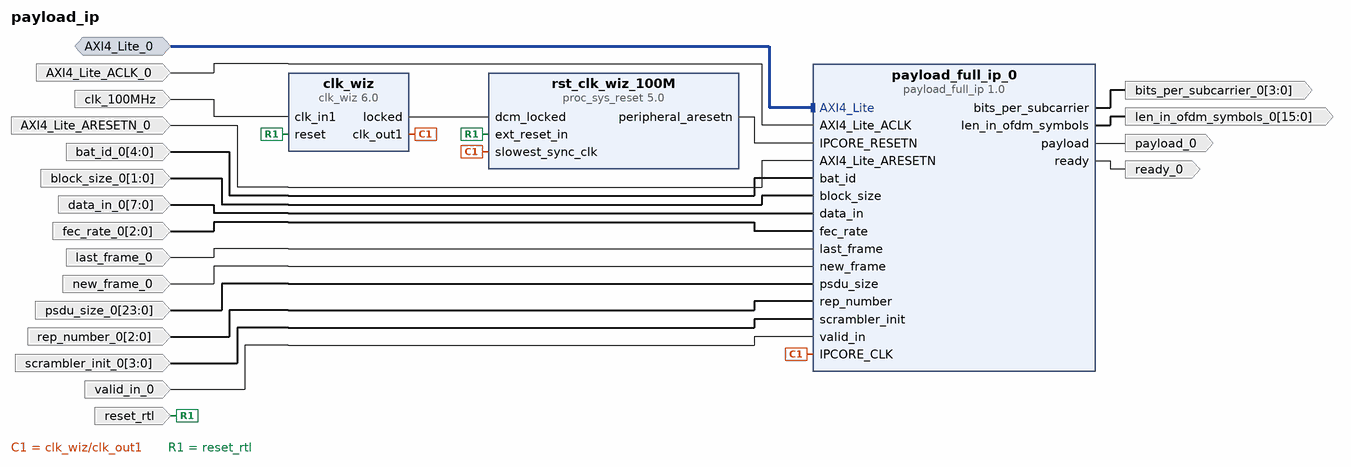
[diagram p0: block diagram of the top level]
# Vivado block design payload_ip, xc7z010clg400-1, Vivado 2023.2
create_bd_design payload_ip

create_bd_intf_port -mode Slave -vlnv xilinx.com:interface:aximm_rtl:1.0 AXI4_Lite_0
set_property -dict [list \
  CONFIG.ADDR_WIDTH 16 \
  CONFIG.ARUSER_WIDTH 0 \
  CONFIG.AWUSER_WIDTH 0 \
  CONFIG.BUSER_WIDTH 0 \
  CONFIG.DATA_WIDTH 32 \
  CONFIG.HAS_BRESP 1 \
  CONFIG.HAS_BURST 0 \
  CONFIG.HAS_CACHE 0 \
  CONFIG.HAS_LOCK 0 \
  CONFIG.HAS_PROT 0 \
  CONFIG.HAS_QOS 0 \
  CONFIG.HAS_REGION 0 \
  CONFIG.HAS_RRESP 1 \
  CONFIG.HAS_WSTRB 1 \
  CONFIG.ID_WIDTH 0 \
  CONFIG.MAX_BURST_LENGTH 1 \
  CONFIG.NUM_READ_OUTSTANDING 1 \
  CONFIG.NUM_READ_THREADS 1 \
  CONFIG.NUM_WRITE_OUTSTANDING 1 \
  CONFIG.NUM_WRITE_THREADS 1 \
  CONFIG.PROTOCOL AXI4LITE \
  CONFIG.READ_WRITE_MODE READ_WRITE \
  CONFIG.RUSER_BITS_PER_BYTE 0 \
  CONFIG.RUSER_WIDTH 0 \
  CONFIG.SUPPORTS_NARROW_BURST 0 \
  CONFIG.WUSER_BITS_PER_BYTE 0 \
  CONFIG.WUSER_WIDTH 0 \
] [get_bd_intf_ports AXI4_Lite_0]
create_bd_port -dir I -type clk clk_100MHz
set_property -dict {CONFIG.FREQ_HZ 100000000} [get_bd_ports clk_100MHz]
create_bd_port -dir I -type rst reset_rtl
set_property -dict {CONFIG.POLARITY ACTIVE_HIGH} [get_bd_ports reset_rtl]
create_bd_port -dir I -type clk AXI4_Lite_ACLK_0
create_bd_port -dir I -type rst AXI4_Lite_ARESETN_0
create_bd_port -dir I -from 4 -to 0 bat_id_0
create_bd_port -dir O -from 3 -to 0 bits_per_subcarrier_0
create_bd_port -dir I -from 1 -to 0 block_size_0
create_bd_port -dir I -from 7 -to 0 data_in_0
create_bd_port -dir I -from 2 -to 0 fec_rate_0
create_bd_port -dir I last_frame_0
create_bd_port -dir O -from 15 -to 0 len_in_ofdm_symbols_0
create_bd_port -dir I new_frame_0
create_bd_port -dir O payload_0
create_bd_port -dir I -from 23 -to 0 psdu_size_0
create_bd_port -dir O ready_0
create_bd_port -dir I -from 2 -to 0 rep_number_0
create_bd_port -dir I -from 3 -to 0 scrambler_init_0
create_bd_port -dir I valid_in_0

create_bd_cell -type ip -vlnv user.org:ip:payload_full_ip:1.0 payload_full_ip_0
create_bd_cell -type ip -vlnv xilinx.com:ip:clk_wiz:6.0 clk_wiz
create_bd_cell -type ip -vlnv xilinx.com:ip:proc_sys_reset:5.0 rst_clk_wiz_100M

# ---- connections ----

connect_bd_intf_net -intf_net AXI4_Lite_0_1 [get_bd_intf_ports AXI4_Lite_0] [get_bd_intf_pins payload_full_ip_0/AXI4_Lite]
connect_bd_net -net AXI4_Lite_ACLK_0_1 [get_bd_ports AXI4_Lite_ACLK_0] [get_bd_pins payload_full_ip_0/AXI4_Lite_ACLK]
connect_bd_net -net AXI4_Lite_ARESETN_0_1 [get_bd_ports AXI4_Lite_ARESETN_0] [get_bd_pins payload_full_ip_0/AXI4_Lite_ARESETN]
connect_bd_net -net bat_id_0_1 [get_bd_ports bat_id_0] [get_bd_pins payload_full_ip_0/bat_id]
connect_bd_net -net block_size_0_1 [get_bd_ports block_size_0] [get_bd_pins payload_full_ip_0/block_size]
connect_bd_net [get_bd_ports clk_100MHz] [get_bd_pins clk_wiz/clk_in1]
connect_bd_net [get_bd_pins clk_wiz/clk_out1] [get_bd_pins payload_full_ip_0/IPCORE_CLK] [get_bd_pins rst_clk_wiz_100M/slowest_sync_clk]
connect_bd_net [get_bd_pins clk_wiz/locked] [get_bd_pins rst_clk_wiz_100M/dcm_locked]
connect_bd_net -net data_in_0_1 [get_bd_ports data_in_0] [get_bd_pins payload_full_ip_0/data_in]
connect_bd_net -net fec_rate_0_1 [get_bd_ports fec_rate_0] [get_bd_pins payload_full_ip_0/fec_rate]
connect_bd_net -net last_frame_0_1 [get_bd_ports last_frame_0] [get_bd_pins payload_full_ip_0/last_frame]
connect_bd_net -net new_frame_0_1 [get_bd_ports new_frame_0] [get_bd_pins payload_full_ip_0/new_frame]
connect_bd_net [get_bd_pins payload_full_ip_0/bits_per_subcarrier] [get_bd_ports bits_per_subcarrier_0]
connect_bd_net [get_bd_pins payload_full_ip_0/len_in_ofdm_symbols] [get_bd_ports len_in_ofdm_symbols_0]
connect_bd_net [get_bd_pins payload_full_ip_0/payload] [get_bd_ports payload_0]
connect_bd_net [get_bd_pins payload_full_ip_0/ready] [get_bd_ports ready_0]
connect_bd_net -net psdu_size_0_1 [get_bd_ports psdu_size_0] [get_bd_pins payload_full_ip_0/psdu_size]
connect_bd_net -net rep_number_0_1 [get_bd_ports rep_number_0] [get_bd_pins payload_full_ip_0/rep_number]
connect_bd_net [get_bd_ports reset_rtl] [get_bd_pins clk_wiz/reset] [get_bd_pins rst_clk_wiz_100M/ext_reset_in]
connect_bd_net [get_bd_pins rst_clk_wiz_100M/peripheral_aresetn] [get_bd_pins payload_full_ip_0/IPCORE_RESETN]
connect_bd_net -net scrambler_init_0_1 [get_bd_ports scrambler_init_0] [get_bd_pins payload_full_ip_0/scrambler_init]
connect_bd_net -net valid_in_0_1 [get_bd_ports valid_in_0] [get_bd_pins payload_full_ip_0/valid_in]

# ---- address map ----
assign_bd_address -offset 0x0000 -range 64K -target_address_space [get_bd_addr_spaces AXI4_Lite_0] [get_bd_addr_segs payload_full_ip_0/AXI4_Lite/reg0]

validate_bd_design
save_bd_design
